# EAGLE design door_sensor (EAGLE 7.6.0)
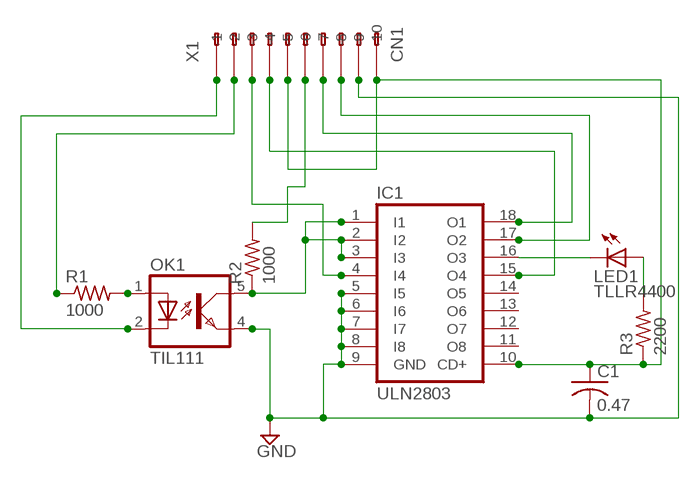
[diagram p0: schematic, sheet 1]

## Parts
C1  0.47  C-US025-024X044  [C025-024X044]
IC1  ULN2803  ULN2803A  [DIL18]
LED1  TLLR4400  [LED3MM]
OK1  TIL111  CNY17F  [DIL06]
R1  1000  R-US_0204/2V  [0204V]
R2  1000  R-US_0204/2V  [0204V]
R3  2200  R-US_0204/2V  [0204V]
X1  CN1  233-210  [233-210]

## Nets
GND: C1.2 IC1.5(I5) IC1.6(I6) IC1.7(I7) IC1.8(I8) IC1.9(GND) OK1.4(EMIT) X1.A9(-9)
N$1: OK1.1(A) R1.2
N$2: OK1.2(C) X1.A1(-1)
N$3: IC1.4(I4) X1.A3(-3)
N$4: IC1.1(I1) IC1.2(I2) IC1.3(I3) OK1.5(COL) R2.1
N$5: IC1.15(O4) X1.A4(-4)
N$6: R1.1 X1.A2(-2)
N$7: R2.2 X1.A6(-6)
N$8: IC1.18(O1) X1.A7(-7)
N$9: IC1.17(O2) X1.A8(-8)
N$10: LED1.A R3.2
N$11: C1.1 IC1.10(CD+) R3.1 X1.A5(-5) X1.A10(-10)
N$12: IC1.16(O3) LED1.K(C)
Unconnected: IC1.11(O8) IC1.12(O7) IC1.13(O6) IC1.14(O5) X1.B1(B-1) X1.B2(B-2) X1.B3(B-3) X1.B4(B-4) X1.B5(B-5) X1.B6(B-6) X1.B7(B-7) X1.B8(B-8) X1.B9(B-9) X1.B10(B-10)

## Library data of the parts
C1 = rcl:C-US: CAPACITOR, American symbol
IC1 = uln-udn:ULN2803A: DRIVER ARRAY
LED1 = led:TLLR4400: Low Current (2mA) LED 3 mm Tinted Diffused Package color RED Source: Data sheet <http://www.farnell.com/datasheets/391100.pdf>; MF: VISHAY SEMICONDUCTOR; OC_FARNELL: 1612437
OK1 = optocoupler:CNY17F: SIEMENS OPTO COUPLER; MF: VISHAY/TELEFUNKEN; MPN: CNY17F-3; OC_FARNELL: 1469473; OC_NEWARK: 58K0172
R1-R3 = resistor:R-US_: RESISTOR, American symbol
X1 = con-wago255:233-210: WAGO; MPN: 233-210; OC_FARNELL: unknown; OC_NEWARK: 28K9067

## Board
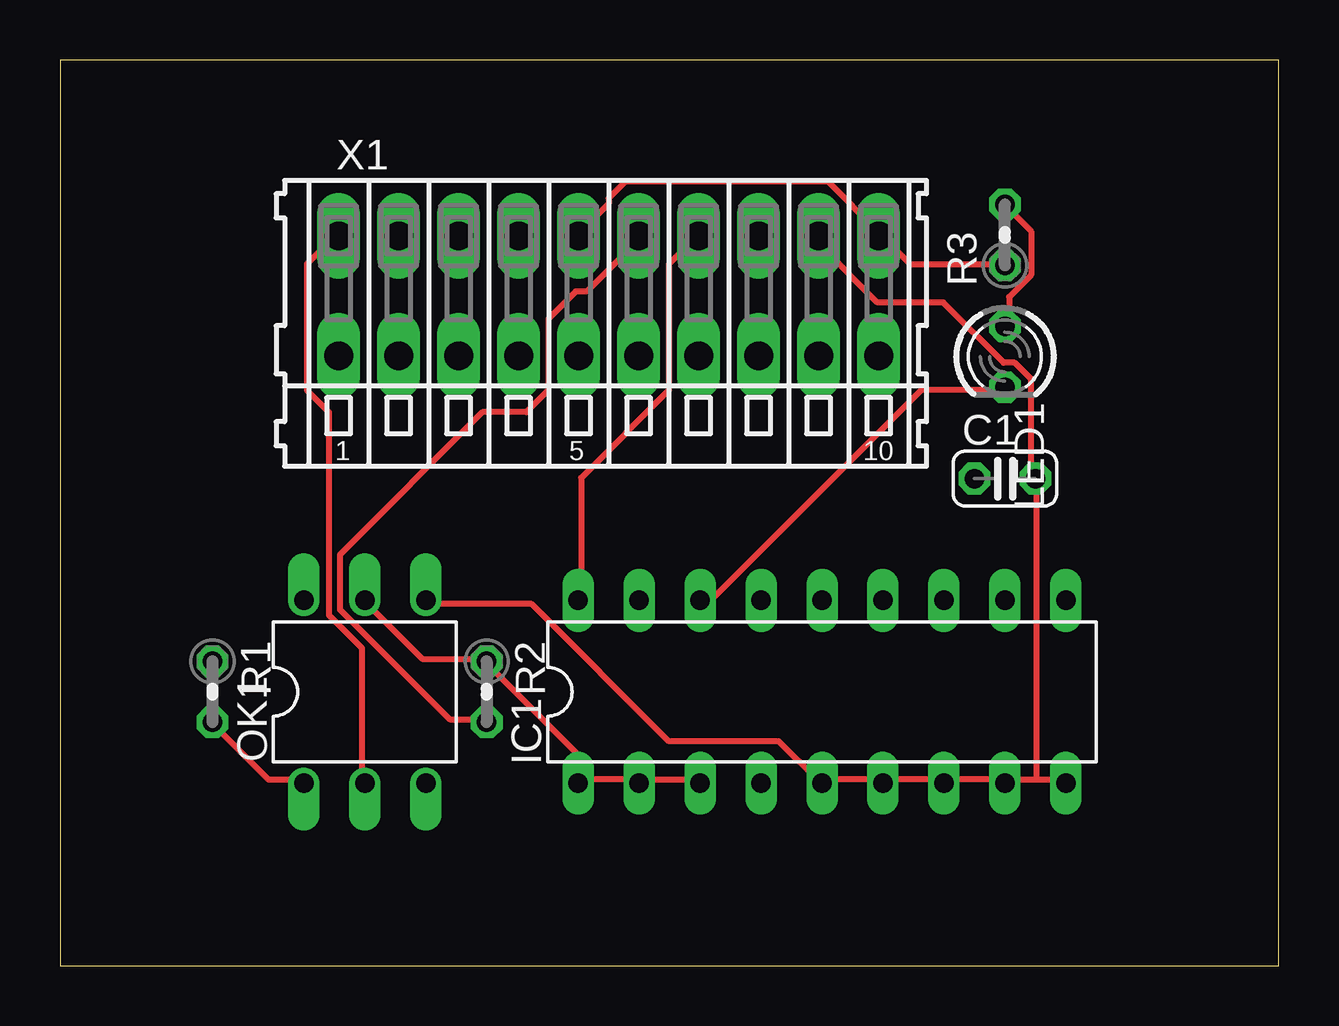
[diagram p1: board, top side]
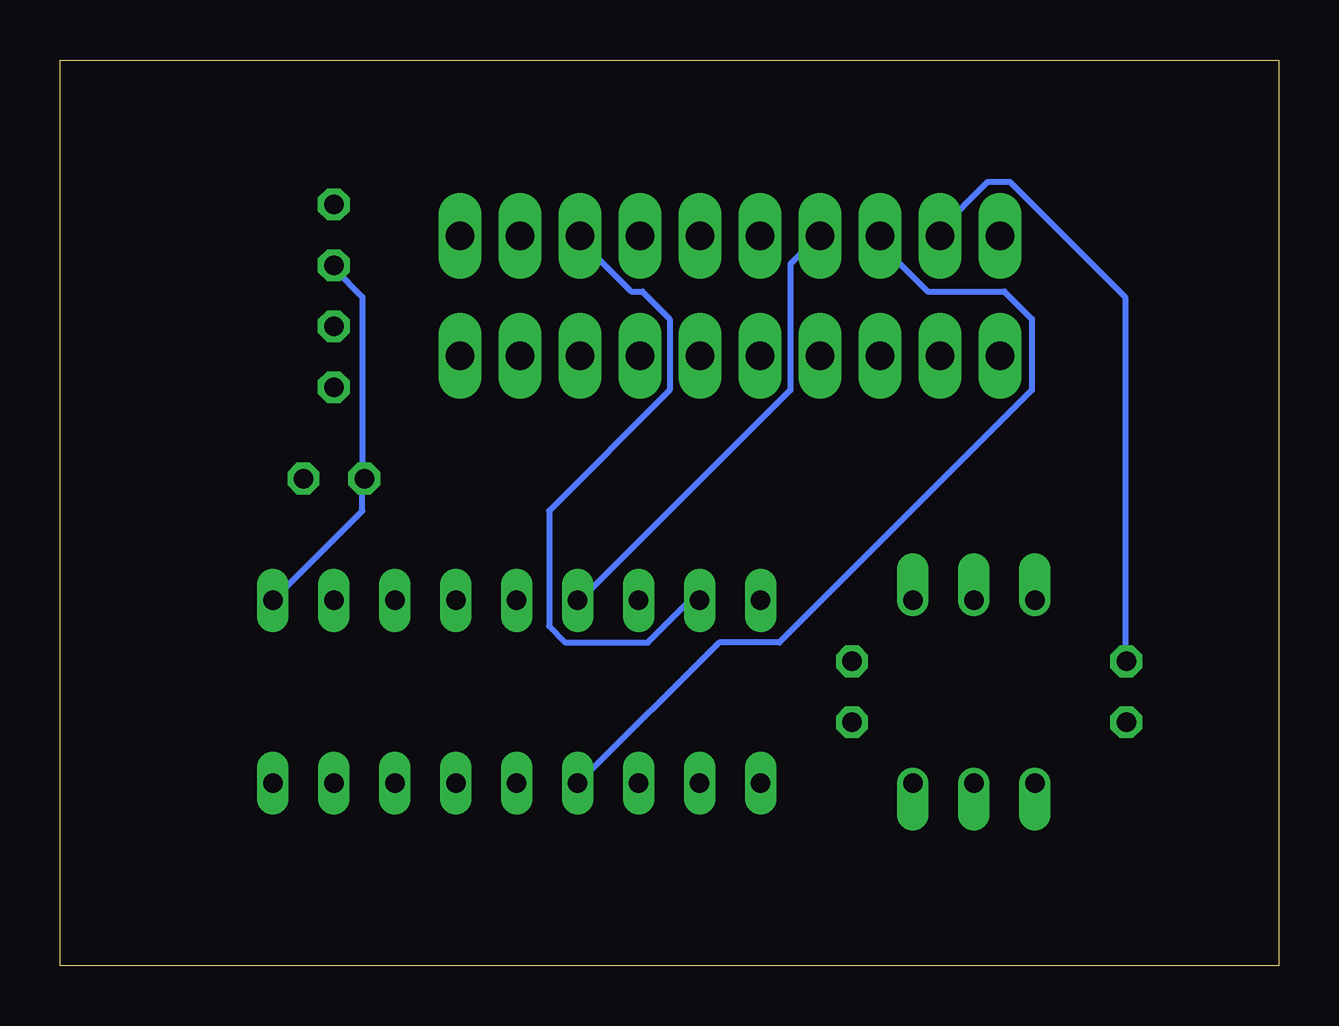
[diagram p2: board, bottom side, seen from below]

Size 50.78 x 37.77 mm. Coordinates in mm from the lower left corner, seen from the top.
Outline: 0,0 50.78,0 50.78,37.77 0,37.77 0,0
Copper layers (1*16): Top 0.035mm / dielectric 1.5mm / Bottom 0.035mm
Design rules "default": minimum track width 10mil, minimum drill 24mil, track to track 8mil, track to pad 8mil, pad to pad 8mil, via to via 8mil, smd to smd 8mil, copper to edge 40mil, drill to drill 8mil, minimum pad ring 10mil, minimum via ring 8mil, stop-mask expansion 4mil, vias tented up to drill 0mil, thermal gap 10mil

### Footprints (pad centres in the part's own frame; a part is rotated, then mirrored left to right if it is on the bottom)
C025-024X044 = drill 0.813 octagon: 1 -1.27,0; 2 1.27,0
DIL18 = drill 0.813 long: 1 -10.16,-3.81; 2 -7.62,-3.81; 3 -5.08,-3.81; 4 -2.54,-3.81; 5 0,-3.81; 6 2.54,-3.81; 7 5.08,-3.81; 8 7.62,-3.81; 9 10.16,-3.81; 10 10.16,3.81; 11 7.62,3.81; 12 5.08,3.81; 13 2.54,3.81; 14 0,3.81; 15 -2.54,3.81; 16 -5.08,3.81; 17 -7.62,3.81; 18 -10.16,3.81
LED3MM = drill 0.813 octagon: A -1.27,0; K 1.27,0
DIL06 = drill 0.813 offset: 1 -2.54,-3.81; 2 0,-3.81; 3 2.54,-3.81; 4 2.54,3.81; 5 0,3.81; 6 -2.54,3.81
0204V = drill 0.813 octagon: 1 -1.27,0; 2 1.27,0
233-210 = drill 1.2 long: A1 -11.25,2.5; A2 -8.75,2.5; A3 -6.25,2.5; A4 -3.75,2.5; A5 -1.25,2.5; A6 1.25,2.5; A7 3.75,2.5; A8 6.25,2.5; A9 8.75,2.5; A10 11.25,2.5; B1 -11.25,-2.5; B2 -8.75,-2.5; B3 -6.25,-2.5; B4 -3.75,-2.5; B5 -1.25,-2.5; B6 1.25,-2.5; B7 3.75,-2.5; B8 6.25,-2.5; B9 8.75,-2.5; B10 11.25,-2.5

### Placement (x,y rotation side)
C1  39.37,20.32 0 top
IC1  31.75,11.43 0 top
LED1  39.37,25.4 270 top
OK1  12.7,11.43 0 top
R1  6.35,11.43 270 top
R2  17.78,11.43 270 top
R3  39.37,30.48 90 top
X1  22.86,27.94 0 top

### Tracks (layer width: path | path; a pad name or v marks a point on that pad's centre or on a via)
GND
  Top 0.254: 34.29,7.77 31.77,7.77 IC1.5 31.55,7.77 29.95,9.37 25.38,9.37 19.66,15.09 15.32,15.09 OK1.4 | 40.69,7.77 39.55,7.77 IC1.8 39.32,7.77 37.03,7.77 IC1.7 36.8,7.77 34.29,7.77 | 40.69,7.77 41.83,7.77 IC1.9 | 40.69,7.77 40.69,20.12 C1.2 40.46,20.34 40.46,24.46 39.78,25.15 39.32,25.15 36.8,27.66 34.06,27.66 31.77,29.95 31.77,30.4 X1.A9 | 34.29,7.77 IC1.6
N$1
  Top 0.254: OK1.1 10.06,7.77 8.69,7.77 6.4,10.06 R1.2
N$2
  Top 0.254: OK1.2 12.57,7.77 12.57,13.26 11.2,14.63 11.2,23.09 10.29,24 10.29,29.26 11.43,30.4 X1.A1
N$3
  Bottom 0.254: IC1.4 29.03,7.77 23.32,13.49 20.8,13.49 10.29,24 10.29,26.98 11.43,28.12 14.63,28.12 16.46,29.95 16.46,30.4 X1.A3
N$4
  Top 0.254: IC1.3 26.52,7.77 24.23,7.77 IC1.2 24,7.77 21.72,7.77 IC1.1 21.49,7.77 21.49,8.91 17.83,12.57 R2.1 17.6,12.8 15.09,12.8 12.8,15.09 OK1.5
N$5
  Bottom 0.254: IC1.15 29.03,15.32 20.34,24 20.34,29.26 19.2,30.4 X1.A4
N$6
  Bottom 0.254: R1.1 6.4,12.8 6.4,27.89 11.2,32.69 12.12,32.69 14.17,30.63 X1.A2
N$7
  Top 0.254: R2.2 17.6,10.29 16.23,10.29 11.66,14.86 11.66,17.14 17.6,23.09 19.43,23.09 20.34,24 20.34,26.98 21.49,28.12 21.95,28.12 24.23,30.4 X1.A6
N$8
  Top 0.254: IC1.18 21.72,15.32 21.72,20.34 25.38,24 25.38,29.26 26.52,30.4 X1.A7
N$9
  Bottom 0.254: IC1.17 24.23,15.09 24.69,15.09 26.29,13.49 29.72,13.49 30.4,14.17 30.4,18.97 25.38,24 25.38,26.98 26.52,28.12 26.98,28.12 29.26,30.4 X1.A8
N$10
  Top 0.254: LED1.A 39.55,26.75 39.55,27.89 40.46,28.8 40.46,30.63 39.55,31.55 R3.2
N$11
  Top 0.254: R3.1 39.32,29.26 35.43,29.26 34.29,30.4 X1.A10 34.06,30.63 32,32.69 23.55,32.69 22.86,32 22.86,31.77 21.72,30.63 X1.A5
  Bottom 0.254: IC1.10 38.18,18.97 38.18,20.12 C1.1 38.18,20.34 38.18,27.89 39.32,29.03 R3.1
N$12
  Top 0.254: IC1.16 26.75,15.32 27.2,15.32 35.89,24 39.32,24 LED1.K